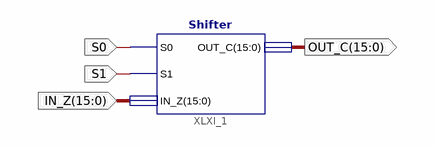
[diagram p0: schematic sheet 1]
// Xilinx ISE schematic Shifter.sch (artix7) as structural Verilog: 1 symbols, 4 ports
module Shifter (
  input  S0,
  input  S1,
  input  [15:0] IN_Z,
  output [15:0] OUT_C
);

  Shifter XLXI_1 (.S0(S0), .S1(S1), .IN_Z(IN_Z), .OUT_C(OUT_C));
endmodule
